# EAGLE schematic supra_redraw (EAGLE 8.5.1)
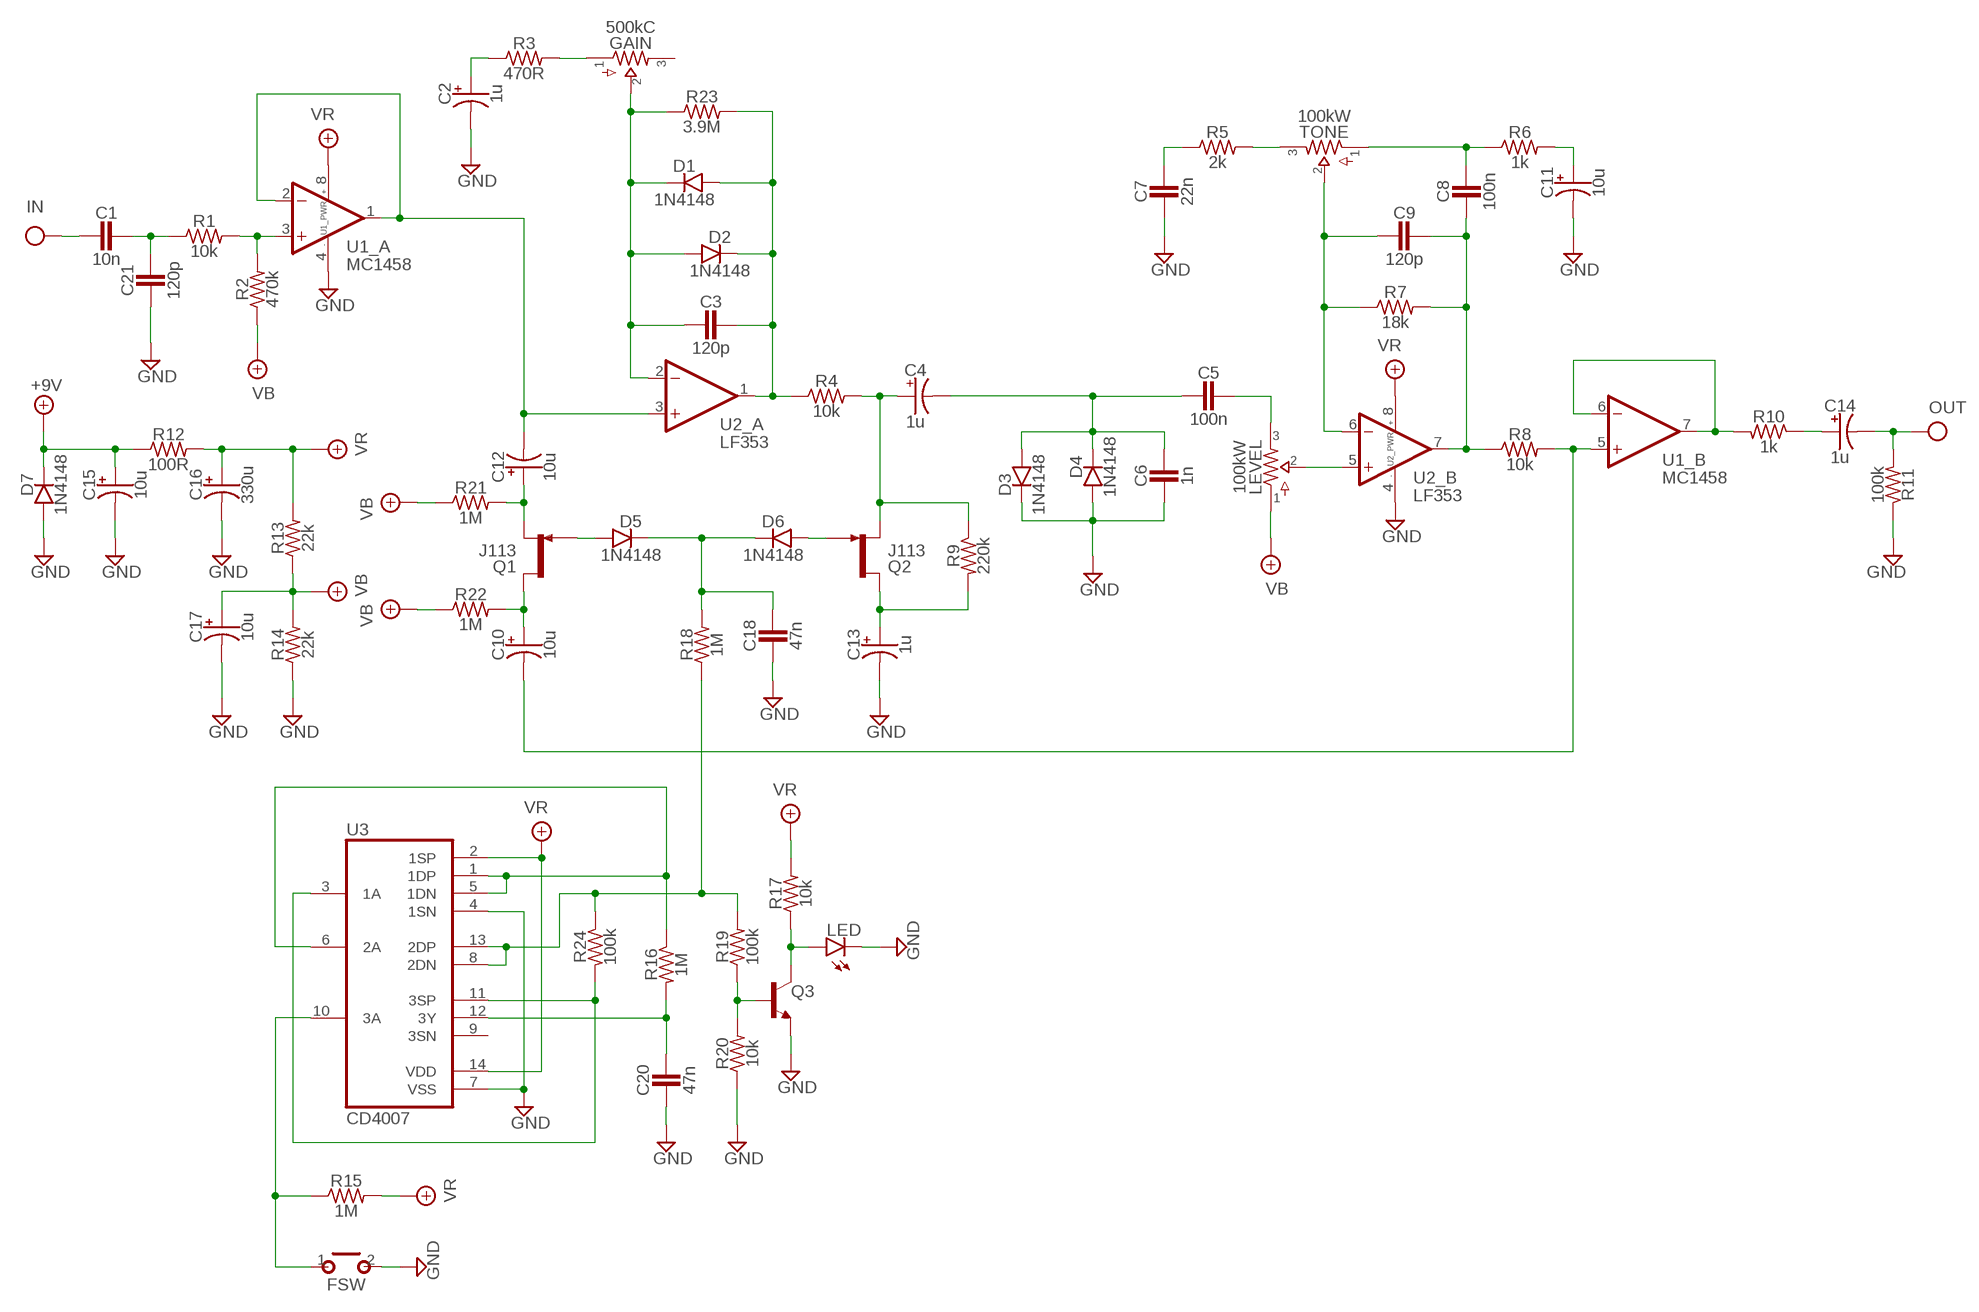
[diagram p0: schematic, sheet 1]

## Parts
C1  10n  CER/FILMBOX.1  [BOX_SMALL]
C2  1u  0500  [050_020]
C3  120p  CER/FILMBOX.1  [BOX_SMALL]
C4  1u  0500  [050_020]
C5  100n  CER/FILMBOX.1  [BOX_SMALL]
C6  1n  CER/FILMBOX.1  [BOX_SMALL]
C7  22n  CER/FILMBOX.1  [BOX_SMALL]
C8  100n  CER/FILMBOX.1  [BOX_SMALL]
C9  120p  CER/FILMBOX.1  [BOX_SMALL]
C10  10u  0500  [050_020]
C11  10u  0500  [050_020]
C12  10u  0500  [050_020]
C13  1u  0500  [050_020]
C14  1u  0500  [050_020]
C15  10u  0500  [050_020]
C16  330u  0500  [050_020]
C17  10u  0500  [050_020]
C18  47n  CER/FILMBOX.1  [BOX_SMALL]
C20  47n  CER/FILMBOX.1  [BOX_SMALL]
C21  120p  CER/FILMBOX.1  [BOX_SMALL]
D1  1N4148  DO35.2  [DO35-2]
D2  1N4148  DO35.2  [DO35-2]
D3  1N4148  DO35.2  [DO35-2]
D4  1N4148  DO35.2  [DO35-2]
D5  1N4148  DO35.2  [DO35-2]
D6  1N4148  DO35.2  [DO35-2]
D7  1N4148  DO35.2  [DO35-2]
FSW  MOMENTARY  [SPST]
GAIN  500kC  POTS16MM  [16MM]
LED  LED  [3MM_D]
LEVEL  100kW  POTS16MM  [16MM]
Q1  J113  2N5457  [TO92-]
Q2  J113  2N5457  [TO92-]
Q3  2N3904  [TO92-]
R1  10k  R_.3B  [R0207/3]
R2  470k  R_.3B  [R0207/3]
R3  470R  R_.3B  [R0207/3]
R4  10k  R_.3B  [R0207/3]
R5  2k  R_.3B  [R0207/3]
R6  1k  R_.3B  [R0207/3]
R7  18k  R_.3B  [R0207/3]
R8  10k  R_.3B  [R0207/3]
R9  220k  R_.3B  [R0207/3]
R10  1k  R_.3B  [R0207/3]
R11  100k  R_.3B  [R0207/3]
R12  100R  R_.3B  [R0207/3]
R13  22k  R_.3B  [R0207/3]
R14  22k  R_.3B  [R0207/3]
R15  1M  R_.3B  [R0207/3]
R16  1M  R_.3B  [R0207/3]
R17  10k  R_.3B  [R0207/3]
R18  1M  R_.3B  [R0207/3]
R19  100k  R_.3B  [R0207/3]
R20  10k  R_.3B  [R0207/3]
R21  1M  R_.3B  [R0207/3]
R22  1M  R_.3B  [R0207/3]
R23  3.9M  R_.3B  [R0207/3]
R24  100k  R_.3B  [R0207/3]
TONE  100kW  POTS16MM  [16MM]
U1  MC1458  DUALTH  [DIL0]
U2  LF353  DUALTH  [DIL0]
U3  CD4007  4007N  [DIL14]

## Nets
+9V: C15.+ D7.C R12.1
GND: C2.- C6.2 C7.2 C11.- C13.- C15.- C16.- C17.- C18.2 C20.2 C21.2 D3.C D4.A D7.A FSW.2(S) LED.P$1(C) Q3.3(E) R11.1 R14.1 R20.1 U1.4(_PWR:V-) U2.4(_PWR:V-) U3.4(1SN) U3.7(VSS)
IN: C1.2
N$5: C1.1 C21.1 R1.1
N$6: R1.2 R2.2 U1.3(_A:+IN)
N$7: C12.- U1.1(_A:OUT) U1.2(_A:-IN) U2.3(_A:+IN)
N$8: C12.+ Q1.2(S) R21.2
N$9: C10.+ Q1.3(D) R22.2
N$11: C14.+ R10.1
N$12: R10.2 U1.6(_B:-IN) U1.7(_B:OUT)
N$13: C10.- R8.2 U1.5(_B:+IN)
N$14: C3.1 D1.A D2.C R4.1 R23.2 U2.1(_A:OUT)
N$15: C3.2 D1.C D2.A GAIN.2 R23.1 U2.2(_A:-IN)
N$16: GAIN.1 R3.2
N$17: C2.+ R3.1
N$18: C4.+ Q2.2(S) R4.2 R9.1
N$19: C13.+ Q2.3(D) R9.2
N$20: D6.A Q2.1(G)
N$21: LED.ANODE(A) Q3.1(C) R17.1
N$22: D5.A Q1.1(G)
N$23: C4.- C5.2 C6.1 D3.A D4.C
N$24: C5.1 LEVEL.3
N$25: LEVEL.2 U2.5(_B:+IN)
N$26: C9.2 R7.1 TONE.2 U2.6(_B:-IN)
N$27: C8.2 C9.1 R7.2 R8.1 U2.7(_B:OUT)
N$28: C8.1 R6.1 TONE.1
N$29: C11.+ R6.2
N$30: R5.2 TONE.3
N$31: C7.1 R5.1
N$32: R18.1 R19.2 R24.1 U3.8(2DN) U3.13(2DP)
N$33: R16.1 U3.1(1DP) U3.5(1DN) U3.6(2A)
N$34: FSW.1(P) R15.1 U3.10(3A)
N$35: C20.1 R16.2 U3.12(3Y)
N$36: Q3.2(B) R19.1 R20.2
N$39: C18.1 D5.C D6.C R18.2
N$40: R24.2 U3.3(1A) U3.11(3SP)
OUT: C14.- R11.2
VB: C17.+ LEVEL.1 R2.1 R13.1 R14.2 R21.1 R22.1
VR: C16.+ R12.2 R13.2 R15.2 R17.2 U1.8(_PWR:V+) U2.8(_PWR:V+) U3.2(1SP) U3.14(VDD)
Unconnected: GAIN.3 U3.9(3SN)

## Library data of the parts
C1 C3 C5-C9 C18 C20 C21 = pedals-capacitors-film:CER/FILM: 47 - 120pF Xicon Ceramic Disc 2.5mm lead spacing
C2 C4 C10-C17 = pedals-capacitors-elec:050
D1-D7 = pedals-diodes:DO35: DO-35 Package Diodes: 1N914
FSW = pedals-switches:MOMENTARY
GAIN LEVEL TONE = pedals-potentiometers:POTS
LED = pedals-diodes:LED
Q1 Q2 = pedals-transistors:2N5457: N-CHANNEL JFET
Q3 = pedals-transistors:2N3904: NPN Transistor
R1-R24 = pedals-resistors:R_
U1 U2 = pedals-integrated circuits:DUAL: OP AMP
U3 = pedals-40xx-2:4007: Dual COMPLIMENTARY PAIR plus INVERTER